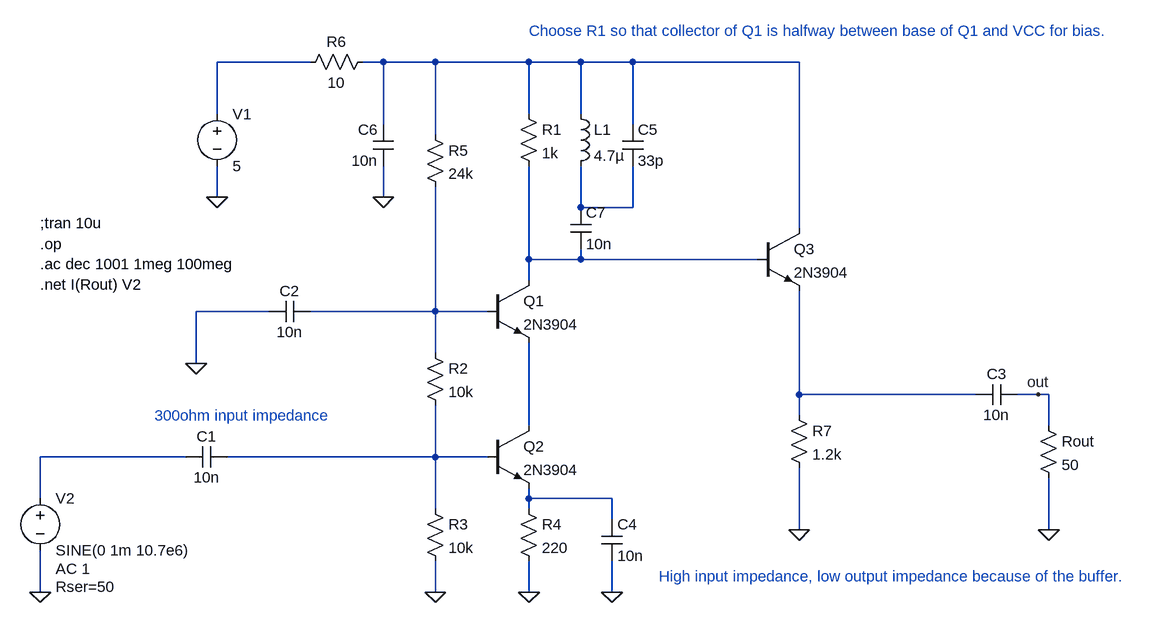
[diagram p0: schematic IF3.asc]
IF3.asc, the LTspice schematic file:
Version 4
SHEET 1 1628 680
WIRE 32 -272 -112 -272
WIRE 144 -272 112 -272
WIRE 224 -272 144 -272
WIRE 368 -272 224 -272
WIRE 448 -272 368 -272
WIRE 528 -272 448 -272
WIRE 784 -272 528 -272
WIRE -112 -192 -112 -272
WIRE 368 -192 368 -272
WIRE 448 -192 448 -272
WIRE 144 -176 144 -272
WIRE 528 -176 528 -272
WIRE 224 -160 224 -272
WIRE -112 -64 -112 -112
WIRE 144 -64 144 -112
WIRE 448 -48 448 -112
WIRE 528 -48 528 -112
WIRE 528 -48 448 -48
WIRE 784 -16 784 -272
WIRE 368 32 368 -112
WIRE 448 32 448 16
WIRE 448 32 368 32
WIRE 720 32 448 32
WIRE 368 64 368 32
WIRE -32 112 -144 112
WIRE 224 112 224 -80
WIRE 224 112 32 112
WIRE 304 112 224 112
WIRE 224 176 224 112
WIRE -144 192 -144 112
WIRE 784 240 784 80
WIRE 1056 240 784 240
WIRE 1152 240 1120 240
WIRE 1168 240 1152 240
WIRE 784 272 784 240
WIRE 368 288 368 160
WIRE 1168 288 1168 240
WIRE -160 336 -384 336
WIRE 224 336 224 256
WIRE 224 336 -96 336
WIRE 304 336 224 336
WIRE -384 400 -384 336
WIRE 368 400 368 384
WIRE 496 400 368 400
WIRE 224 416 224 336
WIRE 368 416 368 400
WIRE 496 432 496 400
WIRE 784 448 784 352
WIRE 1168 448 1168 368
WIRE -384 544 -384 480
WIRE 224 544 224 496
WIRE 368 544 368 496
WIRE 496 544 496 496
FLAG -112 -64 0
FLAG 224 544 0
FLAG 368 544 0
FLAG -384 544 0
FLAG -144 192 0
FLAG 1168 448 0
FLAG 1152 240 out
FLAG 144 -64 0
FLAG 496 544 0
FLAG 784 448 0
DATAFLAG 112 336 ""
DATAFLAG 112 112 ""
DATAFLAG 608 32 ""
DATAFLAG 896 240 ""
DATAFLAG 480 400 ""
DATAFLAG 368 208 ""
SYMBOL npn 304 64 R0
SYMATTR InstName Q1
SYMATTR Value 2N3904
SYMBOL npn 304 288 R0
SYMATTR InstName Q2
SYMATTR Value 2N3904
SYMBOL res 208 160 R0
SYMATTR InstName R2
SYMATTR Value 10k
SYMBOL res 208 400 R0
SYMATTR InstName R3
SYMATTR Value 10k
SYMBOL res 352 400 R0
SYMATTR InstName R4
SYMATTR Value 220
SYMBOL cap -96 320 R90
WINDOW 0 0 32 VBottom 2
WINDOW 3 32 32 VTop 2
SYMATTR InstName C1
SYMATTR Value 10n
SYMBOL voltage -112 -208 R0
WINDOW 123 0 0 Left 0
WINDOW 39 0 0 Left 0
SYMATTR InstName V1
SYMATTR Value 5
SYMBOL voltage -384 384 R0
WINDOW 123 24 124 Left 2
WINDOW 39 24 152 Left 2
SYMATTR Value2 AC 1
SYMATTR SpiceLine Rser=50
SYMATTR InstName V2
SYMATTR Value SINE(0 1m 10.7e6)
SYMBOL res 208 -176 R0
SYMATTR InstName R5
SYMATTR Value 24k
SYMBOL cap 32 96 R90
WINDOW 0 0 32 VBottom 2
WINDOW 3 32 32 VTop 2
SYMATTR InstName C2
SYMATTR Value 10n
SYMBOL res 1152 272 R0
SYMATTR InstName Rout
SYMATTR Value 50
SYMBOL cap 1120 224 R90
WINDOW 0 0 32 VBottom 2
WINDOW 3 32 32 VTop 2
SYMATTR InstName C3
SYMATTR Value 10n
SYMBOL res 352 -208 R0
SYMATTR InstName R1
SYMATTR Value 1k
SYMBOL res 128 -288 R90
WINDOW 0 0 56 VBottom 2
WINDOW 3 32 56 VTop 2
SYMATTR InstName R6
SYMATTR Value 10
SYMBOL cap 160 -112 R180
WINDOW 0 24 56 Left 2
WINDOW 3 24 8 Left 2
SYMATTR InstName C6
SYMATTR Value 10n
SYMBOL cap 480 432 R0
SYMATTR InstName C4
SYMATTR Value 10n
SYMBOL ind 432 -208 R0
SYMATTR InstName L1
SYMATTR Value 4.7µ
SYMBOL cap 512 -176 R0
SYMATTR InstName C5
SYMATTR Value 33p
SYMBOL cap 432 -48 R0
SYMATTR InstName C7
SYMATTR Value 10n
SYMBOL npn 720 -16 R0
SYMATTR InstName Q3
SYMATTR Value 2N3904
SYMBOL res 768 256 R0
SYMATTR InstName R7
SYMATTR Value 1.2k
TEXT -384 -24 Left 2 !;tran 10u
TEXT -208 272 Left 2 ;300ohm input impedance
TEXT 368 -320 Left 2 ;Choose R1 so that collector of Q1 is halfway between base of Q1 and VCC for bias.
TEXT 568 520 Left 2 ;High input impedance, low output impedance because of the buffer.
TEXT -384 8 Left 2 !.op\n.ac dec 1001 1meg 100meg\n.net I(Rout) V2

The netlist it stands for:
* IF3.asc
Q1 N004 N005 N007 0 2N3904
Q2 N007 N009 N010 0 2N3904
R2 N005 N009 10k
R3 N009 0 10k
R4 N010 0 220
C1 N009 N008 10n
V1 N001 0 5
V2 N008 0 SINE(0 1m 10.7e6) AC 1 Rser=50
R5 N002 N005 24k
C2 N005 0 10n
Rout out 0 50
C3 out N006 10n
R1 N002 N004 1k
R6 N002 N001 10
C6 0 N002 10n
C4 N010 0 10n
L1 N002 N003 4.7µ
C5 N002 N003 33p
C7 N003 N004 10n
Q3 N002 N004 N006 0 2N3904
R7 N006 0 1.2k
.model NPN NPN
.model PNP PNP
.lib standard.bjt
;tran 10u
* 300ohm input impedance
* Choose R1 so that collector of Q1 is halfway between base of Q1 and VCC for bias.
* High input impedance, low output impedance because of the buffer.
.op
.ac dec 1001 1meg 100meg
.net I(Rout) V2
.backanno
.end